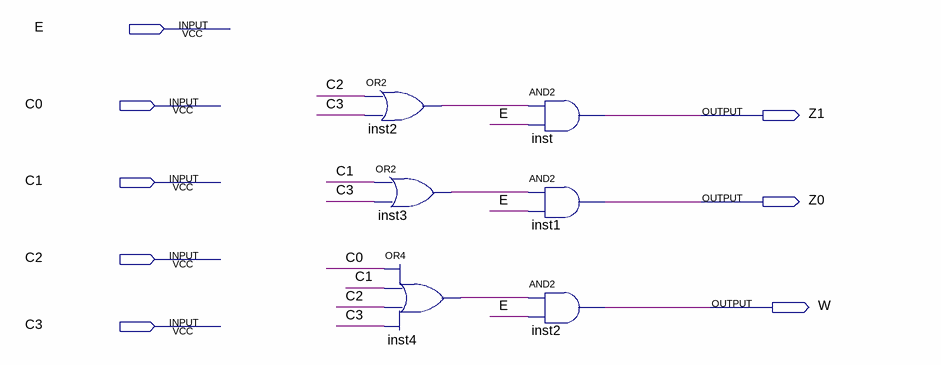
[diagram p0: schematic sheet]
// Quartus schematic MojCD.bdf as structural Verilog: 6 symbols, 8 pins
module MojCD (
  input  E,
  input  C0,
  input  C1,
  input  C2,
  input  C3,
  output Z1,
  output Z0,
  output W
);

  wire inst2_out, inst3_out, inst4_out;

  or inst2 (inst2_out, C2, C3);
  or inst3 (inst3_out, C1, C3);
  or inst4 (inst4_out, C0, C1, C2, C3);
  and inst (Z1, inst2_out, E);
  and inst1 (Z0, inst3_out, E);
  and inst2_dup2 (W, inst4_out, E);
endmodule
